# EAGLE design ArduinoLabDaughter (EAGLE 5.11)
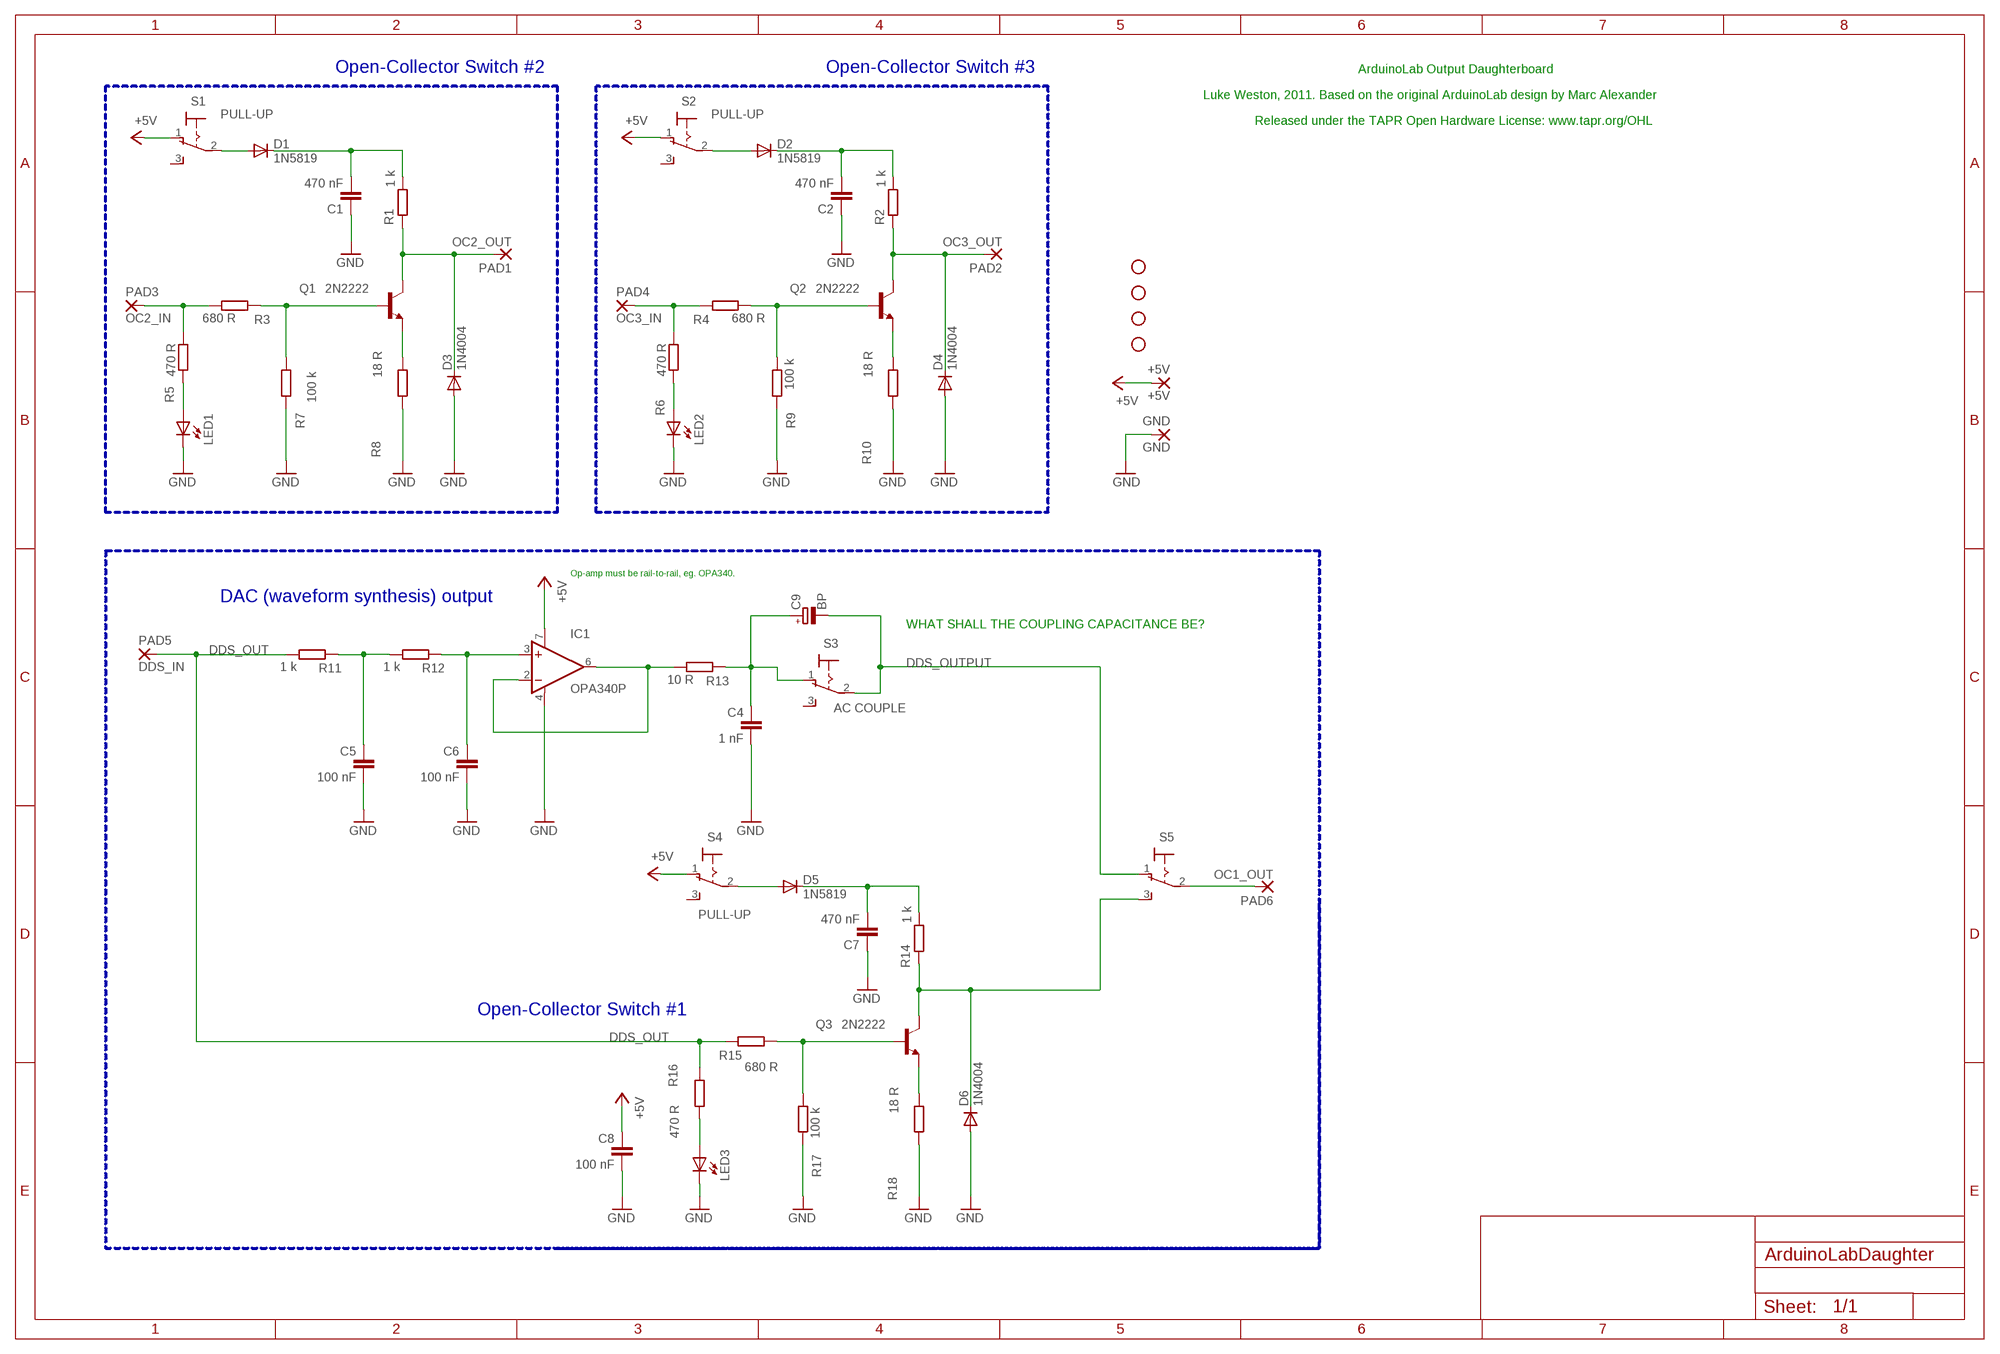
[diagram p0: schematic, sheet 1]

## Parts
+5V  +5V  WIREPAD3,81/1,3  [3,81/1,3]
C1  470 nF  C-EU025-024X044  [C025-024X044]
C2  470 nF  C-EU025-024X044  [C025-024X044]
C4  1 nF  C-EU025-024X044  [C025-024X044]
C5  100 nF  C-EU025-024X044  [C025-024X044]
C6  100 nF  C-EU025-024X044  [C025-024X044]
C7  470 nF  C-EU025-024X044  [C025-024X044]
C8  100 nF  C-EU025-024X044  [C025-024X044]
C9  BP  CPOL-EUE2.5-7  [E2,5-7]
D1  1N5819  DIODE-D-10  [D-10]
D2  1N5819  DIODE-D-10  [D-10]
D3  1N4004  DIODE-D-10  [D-10]
D4  1N4004  DIODE-D-10  [D-10]
D5  1N5819  DIODE-D-10  [D-10]
D6  1N4004  DIODE-D-10  [D-10]
GND  GND  WIREPAD3,81/1,3  [3,81/1,3]
IC1  OPA340P  [DIL08]
JP1  STAND-OFF  [STAND-OFF]
JP2  STAND-OFF  [STAND-OFF]
JP3  STAND-OFF  [STAND-OFF]
JP4  STAND-OFF  [STAND-OFF]
LED1  LED3MM  [LED3MM]
LED2  LED3MM  [LED3MM]
LED3  LED3MM  [LED3MM]
PAD1  OC2_OUT  WIREPAD3,81/1,3  [3,81/1,3]
PAD2  OC3_OUT  WIREPAD3,81/1,3  [3,81/1,3]
PAD3  OC2_IN  WIREPAD3,81/1,3  [3,81/1,3]
PAD4  OC3_IN  WIREPAD3,81/1,3  [3,81/1,3]
PAD5  DDS_IN  WIREPAD3,81/1,3  [3,81/1,3]
PAD6  OC1_OUT  WIREPAD3,81/1,3  [3,81/1,3]
Q1  2N2222  [TO92-EBC-OVAL]
Q2  2N2222  [TO92-EBC-OVAL]
Q3  2N2222  [TO92-EBC-OVAL]
R1  1 k  R-EU_0207/10  [0207/10]
R2  1 k  R-EU_0207/10  [0207/10]
R3  680 R  R-EU_0207/10  [0207/10]
R4  680 R  R-EU_0207/10  [0207/10]
R5  470 R  R-EU_0207/10  [0207/10]
R6  470 R  R-EU_0207/10  [0207/10]
R7  100 k  R-EU_0207/10  [0207/10]
R8  18 R  R-EU_0207/10  [0207/10]
R9  100 k  R-EU_0207/10  [0207/10]
R10  18 R  R-EU_0207/10  [0207/10]
R11  1 k  R-EU_0207/10  [0207/10]
R12  1 k  R-EU_0207/10  [0207/10]
R13  10 R  R-EU_0207/10  [0207/10]
R14  1 k  R-EU_0207/10  [0207/10]
R15  680 R  R-EU_0207/10  [0207/10]
R16  470 R  R-EU_0207/10  [0207/10]
R17  100 k  R-EU_0207/10  [0207/10]
R18  18 R  R-EU_0207/10  [0207/10]
S1  PULL-UP  320-916  [320-916]
S2  PULL-UP  320-916  [320-916]
S3  AC COUPLE  320-916  [320-916]
S4  PULL-UP  320-916  [320-916]
S5  320-916  [320-916]

## Nets
+5V: +5V.1(P) C8.1 IC1.7(V+) S1.1(O) S2.1(O) S4.1(O)
DDS_OUT: PAD5.1(P) R11.1 R15.1 R16.2
DDS_OUTPUT: C9.- S3.2(P) S5.1(O)
GND: C1.1 C2.1 C4.2 C5.2 C6.2 C7.1 C8.2 D3.A D4.A D6.A GND.1(P) IC1.4(V-) LED1.K(C) LED2.K(C) LED3.K(C) R7.1 R8.2 R9.1 R10.2 R17.1 R18.2
N$2: PAD6.1(P) S5.2(P)
N$34: Q1.B R3.2 R7.2
N$35: Q3.B R15.2 R17.2
N$36: Q3.E R18.1
N$37: IC1.2(-IN) IC1.6(OUT) R13.1
N$40: D6.C Q3.C R14.2 S5.3(S)
N$41: C7.2 D5.C R14.1
N$49: C4.1 C9.+ R13.2 S3.1(O)
N$50: Q1.E R8.1
N$55: D3.C PAD1.1(P) Q1.C R1.2
N$56: C5.1 R11.2 R12.1
N$57: C6.1 IC1.3(+IN) R12.2
N$61: LED3.A R16.1
N$62: D5.A S4.2(P)
N$63: C1.2 D1.C R1.1
N$64: LED1.A R5.1
N$65: D1.A S1.2(P)
N$66: Q2.B R4.2 R9.2
N$67: Q2.E R10.1
N$68: D4.C PAD2.1(P) Q2.C R2.2
N$69: C2.2 D2.C R2.1
N$70: LED2.A R6.1
N$71: D2.A S2.2(P)
OC2_OUT: PAD3.1(P) R3.1 R5.2
OC3_OUT: PAD4.1(P) R4.1 R6.2
Unconnected: S1.3(S) S2.3(S) S3.3(S) S4.3(S)

## Buses
B$1

## Notes on the sheet
- Open-Collector Switch #2 | Open-Collector Switch #3 | ArduinoLab Output Daughterboard
- Luke Weston, 2011. Based on the original ArduinoLab design by Marc Alexander
- Released under the TAPR Open Hardware License: www.tapr.org/OHL
- Op-amp must be rail-to-rail, eg. OPA340.
- DAC (waveform synthesis) output
- WHAT SHALL THE COUPLING CAPACITANCE BE?
- Open-Collector Switch #1

## Library data of the parts
+5V GND PAD1-PAD6 = wirepad:WIREPAD: Wire PAD connect wire on PCB
C1 C2 C4-C8 = rcl:C-EU: CAPACITOR, European symbol
C9 = rcl:CPOL-EU: POLARIZED CAPACITOR, European symbol
D1-D6 = diode:DIODE-: DIODE
IC1 = burr-brown:OPA340: Rail-to-Rail Operational Amplifiers Single-Supply, MicroAmplifier(TM) Series
JP1-JP4 = SparkFun:STAND-OFF: Stand Off This is the mechanical footprint for a #4 phillips button head screw. Use the keepout ring to avoid running the screw head into surrounding components. SKU : PRT-00447
LED1-LED3 = led:LED: LED OSRAM: - CHIPLED LG R971, LG N971, LY N971, LG Q971, LY Q971, LO R971, LY R971 LH N974, LH R974 LS Q976, LO Q976, LY Q976 LO Q996 - Hyper CHIPLED LW Q18S LB Q993, LB Q99A, LB R99A - SideLED LS A670, LO A670, LY A670, LG A670, LP A670 LB A673, LV A673, LT A673, LW A673 LH A674 LY A675 LS A676, LA A676, LO A676, LY A676, LW A676 LS A679, LY A679, LG A679 - Hyper Micro SIDELED® LS Y876, LA Y876, LO Y876, LY Y876 LT Y87S - SmartLED LW L88C, LW L88S LB L89C, LB L89S, LG L890 LS L89K, LO L89K, LY L89K LS L896, LA L896, LO L896, LY L896 - TOPLED LS T670, LO T670, LY T670, LG T670, LP T670 LSG T670, LSP T670, LSY T670, LOP T670, LYG T670 LG T671, LOG T671, LSG T671 LB T673, LV T673, LT T673, LW T673 LH T674 LS T676, LA T676, LO T676, LY T676, LB T676, LH T676, LSB T676, LW T676 LB T67C, LV T67C, LT T67C, LS T67K, LO T67K, LY T67K, LW E67C LS E67B, LA E67B, LO E67B, LY E67B, LB E67C, LV E67C, LT E67C LW T67C LS T679, LY T679, LG T679 LS T770, LO T770, LY T770, LG T770, LP T770 LB T773, LV T773, LT T773, LW T773 LH T774 LS E675, LA E675, LY E675, LS T675 LS T776, LA T776, LO T776, LY T776, LB T776 LHGB T686 LT T68C, LB T68C - Hyper Mini TOPLED® LB M676 - Mini TOPLED Santana® LG M470 LS M47K, LO M47K, LY M47K Source: http://www.osram.convergy.de LUXEON: - LUMILED® LXK2-PW12-R00, LXK2-PW12-S00, LXK2-PW14-U00, LXK2-PW14-V00 LXK2-PM12-R00, LXK2-PM12-S00, LXK2-PM14-U00 LXK2-PE12-Q00, LXK2-PE12-R00, LXK2-PE12-S00, LXK2-PE14-T00, LXK2-PE14-U00 LXK2-PB12-K00, LXK2-PB12-L00, LXK2-PB12-M00, LXK2-PB14-N00, LXK2-PB14-P00, LXK2-PB14-Q00 LXK2-PR12-L00, LXK2-PR12-M00, LXK2-PR14-Q00, LXK2-PR14-R00 LXK2-PD12-Q00, LXK2-PD12-R00, LXK2-PD12-S00 LXK2-PH12-R00, LXK2-PH12-S00 LXK2-PL12-P00, LXK2-PL12-Q00, LXK2-PL12-R00 Source: www.luxeon.com KINGBRIGHT: KA-3528ASYC Source: www.kingbright.com
Q1-Q3 = adafruit:2N2222: NPN TRANSISTOR Big oval pads
R1-R18 = rcl:R-EU_: RESISTOR, European symbol
S1-S5 = switch:320-916: TOGGLE SWITCH distributor RS Components

## Board
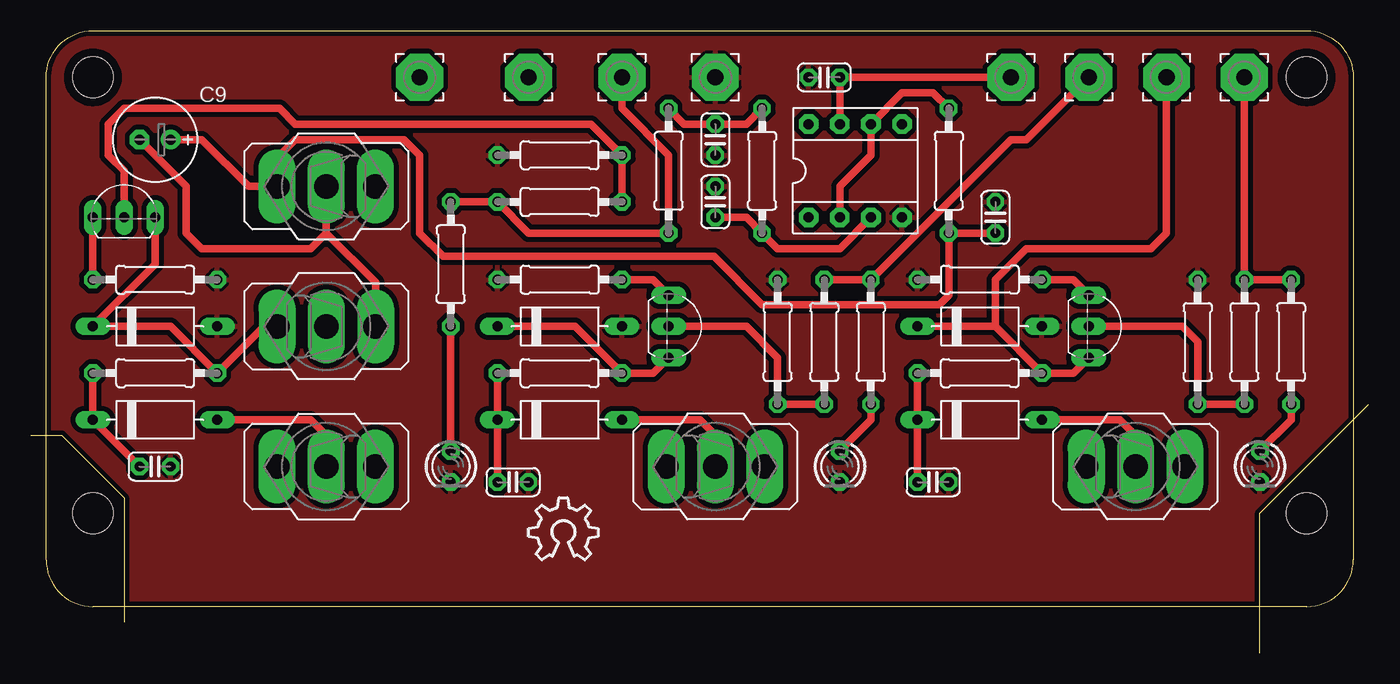
[diagram p1: board, top side]
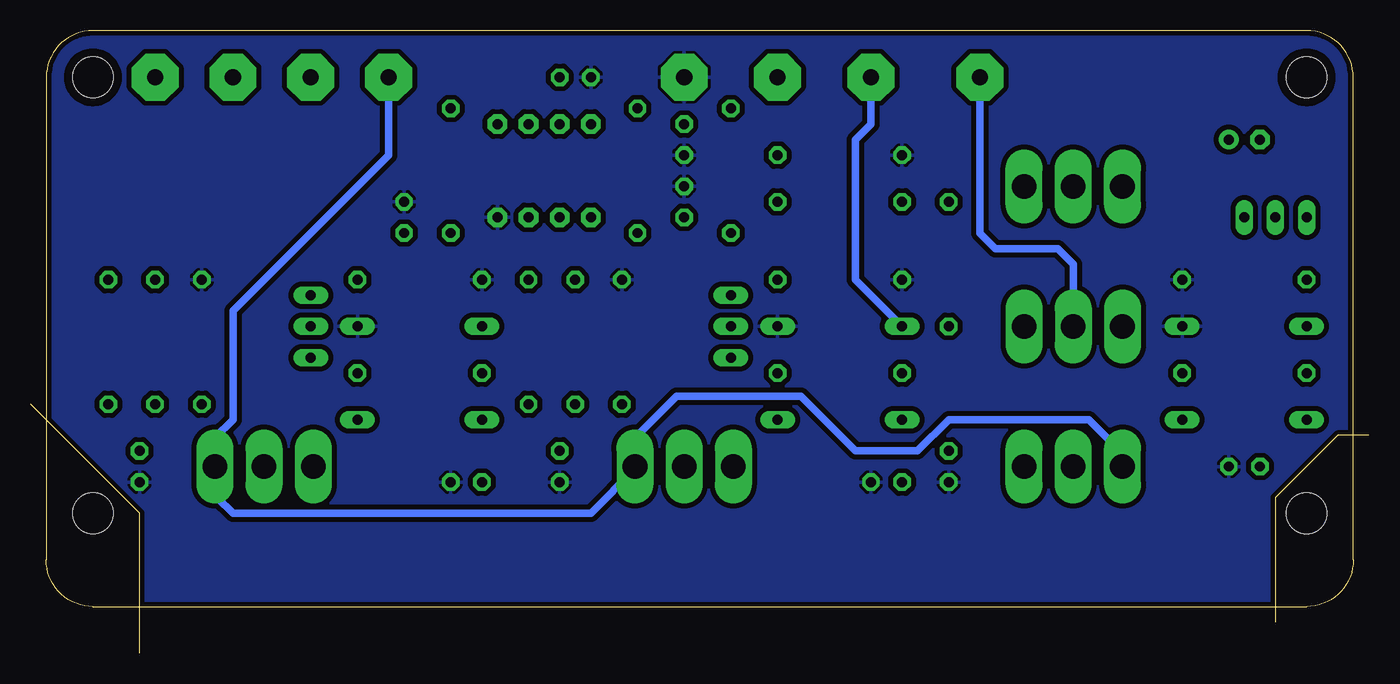
[diagram p2: board, bottom side, seen from below]

Size 109.22 x 50.8 mm. Coordinates in mm from the lower left corner, seen from the top.
Outline: 0,17.78 2.54,17.78 7.62,12.7 7.62,2.54
Outline: 100.33,0 100.33,11.43 109.22,20.32
Outline: 5.08,50.8 104.14,50.8 arc-90 107.95,46.99 107.95,7.62 arc-90 104.14,3.81 5.08,3.81 arc-90 1.27,7.62 1.27,46.99 arc-90 5.08,50.8
Copper layers (1*16): Top 0.035mm / dielectric 1.5mm / Bottom 0.035mm
Design rules "SparkFun.drc": minimum track width 8mil, minimum drill 20mil, track to track 8mil, track to pad 8mil, pad to pad 8mil, via to via 8mil, smd to smd 8mil, copper to edge 10mil, drill to drill 8mil, minimum pad ring 12mil, minimum via ring 10mil, stop-mask expansion 4mil, vias tented up to drill 25mil, thermal gap 10mil

### Footprints (pad centres in the part's own frame; a part is rotated, then mirrored left to right if it is on the bottom)
3,81/1,3 = drill 1.321 pad 3.81 octagon: 1 0,0
C025-024X044 = drill 0.813 octagon: 1 -1.27,0; 2 1.27,0
E2,5-7 = drill 0.813 pad 1.6 round: + -1.27,0 | drill 0.813 pad 1.6 octagon: - 1.27,0
D-10 = drill 0.813 long: A 5.08,0; C -5.08,0
DIL08 = drill 0.813 pad 1.6 octagon: 1 -3.81,-3.81; 2 -1.27,-3.81; 3 1.27,-3.81; 4 3.81,-3.81; 5 3.81,3.81; 6 1.27,3.81; 7 -1.27,3.81; 8 -3.81,3.81
STAND-OFF = hole 3.302: 0,0
LED3MM = drill 0.813 octagon: A -1.27,0; K 1.27,0
TO92-EBC-OVAL = drill 0.813 long: B 0,-1.27; C 2.54,-1.27; E -2.54,-1.27
0207/10 = drill 0.813 octagon: 1 -5.08,0; 2 5.08,0
320-916 = drill 2.007 long: 1 0,4.013; 2 0,0; 3 0,-4.013

### Placement (x,y rotation side)
+5V  80.01,46.99 0 top
C1  39.37,13.97 180 top
C2  73.66,13.97 180 top
C4  78.74,35.56 90 top
C5  55.88,41.91 270 top
C6  55.88,36.83 90 top
C7  10.16,15.24 180 top
C8  64.77,46.99 180 top
C9  10.16,41.91 180 top
D1  43.18,19.05 0 top
D2  77.47,19.05 0 top
D3  43.18,26.67 0 top
D4  77.47,26.67 0 top
D5  10.16,19.05 0 top
D6  10.16,26.67 0 top
GND  55.88,46.99 0 top
IC1  67.31,39.37 0 top
JP1  5.08,46.99 0 top
JP2  5.08,11.43 0 top
JP3  104.14,46.99 0 top
JP4  104.14,11.43 0 top
LED1  66.04,15.24 270 top
LED2  100.33,15.24 270 top
LED3  34.29,15.24 270 top
PAD1  40.64,46.99 180 top
PAD2  92.71,46.99 180 top
PAD3  86.36,46.99 180 top
PAD4  99.06,46.99 180 top
PAD5  48.26,46.99 180 top
PAD6  31.75,46.99 0 top
Q1  53.34,26.67 270 top
Q2  87.63,26.67 270 top
Q3  7.62,36.83 0 top
R1  43.18,22.86 0 top
R2  77.47,22.86 0 top
R3  64.77,25.4 270 top
R4  99.06,25.4 270 top
R5  68.58,25.4 90 top
R6  102.87,25.4 90 top
R7  60.96,25.4 270 top
R8  43.18,30.48 180 top
R9  95.25,25.4 270 top
R10  77.47,30.48 180 top
R11  52.07,39.37 90 top
R12  59.69,39.37 270 top
R13  74.93,39.37 270 top
R14  10.16,22.86 0 top
R15  43.18,36.83 0 top
R16  34.29,31.75 90 top
R17  43.18,40.64 0 top
R18  10.16,30.48 0 top
S1  55.88,15.24 270 top
S2  90.17,15.24 270 top
S3  24.13,38.1 90 top
S4  24.13,15.24 90 top
S5  24.13,26.67 270 top
U$1  [OSHW_10X200_NOTEXT]  40.64,7.62 0 top

### Tracks (layer width: path | path; a pad name or v marks a point on that pad's centre or on a via)
+5V
  Top 0.61: IC1.7 C8.1 +5V.1
  Bottom 0.406: S1.1 59.89,15.04
  Bottom 0.61: S1.1 59.89,17.58 56.52,20.95 46.35,20.95 41.91,16.51 36.83,16.51 34.29,19.05 22.86,19.05 20.32,16.51 20.32,15.24 S4.1 | 59.89,15.04 63.5,11.43 92.71,11.43 93.98,12.7 93.98,15.04 S2.1 94.18,17.58 92.71,19.05 92.71,27.94 80.01,40.64 +5V.1
DDS_OUT
  Top 0.61: R16.2 R15.1 40.64,34.29 R11.1 52.07,40.64 48.26,44.45 PAD5.1
DDS_OUTPUT
  Top 0.61: 24.13,34.29 S3.2 | S5.1 28.14,30.28 24.13,34.29 | 24.13,34.29 22.86,33.02 13.97,33.02 12.7,34.29 12.7,38.1 C9.-
GND
  pour Top (isolate 0.406): 111.76,1.27 -2.54,1.27 -2.54,55.88 111.76,55.88
  pour Bottom (isolate 0.406): -1.27,53.34 109.22,53.34 109.22,2.54 -1.27,2.54
N$2
  Bottom 0.61: S5.2 24.13,31.75 25.4,33.02 30.48,33.02 31.75,34.29 PAD6.1
N$34
  Top 0.61: Q1.B 58.42,26.67 60.96,24.13 R7.2 R3.2
N$35
  Top 0.61: R15.2 R17.2 45.72,43.18 21.59,43.18 20.32,44.45 7.62,44.45 6.35,43.18 6.35,40.64 7.62,39.37 Q3.B
N$36
  Top 0.61: R18.1 Q3.E
N$37
  Top 0.61: IC1.2 66.04,38.1 68.58,40.64 IC1.6 71.12,45.72 73.66,45.72 R13.1
N$40
  Top 0.61: Q3.C 10.16,31.75 D6.C 11.43,26.67 R14.2 19.05,26.67 S5.3
N$41
  Top 0.61: R14.1 D5.C C7.2
N$49
  Top 0.61: C4.1 R13.2 74.93,29.21 74.17,28.45 59.69,28.45 55.75,32.39 33.66,32.39 31.75,34.29 31.75,40.64 30.48,41.91 21.59,41.91 20.12,40.44 S3.1 17.78,38.1 13.97,41.91 C9.+
N$50
  Top 0.61: R8.1 50.8,30.48 Q1.E
N$55
  Top 0.61: Q1.C 50.8,22.86 R1.2 44.45,26.67 D3.C
  Bottom 0.61: D3.C 41.91,30.48 41.91,41.91 40.64,43.18 PAD1.1
N$56
  Top 0.61: R11.2 53.34,43.18 C5.1 58.42,43.18 R12.1
N$57
  Top 0.61: C6.1 58.42,35.56 R12.2 60.96,33.02 66.04,33.02 IC1.3
N$61
  Top 0.61: LED3.A R16.1
N$62
  Top 0.61: D5.A 22.86,19.05 24.13,17.78 S4.2
N$63
  Top 0.61: C1.2 D1.C R1.1
N$64
  Top 0.61: R5.1 68.58,19.05 LED1.A
N$65
  Top 0.61: D1.A 54.61,19.05 55.88,17.78 S1.2
N$66
  Top 0.61: R4.2 R9.2 95.25,25.4 93.98,26.67 Q2.B
N$67
  Top 0.61: Q2.E 85.09,30.48 R10.1
N$68
  Top 0.61: 78.74,26.67 R2.2 85.09,22.86 Q2.C | D4.C 78.74,26.67 | PAD2.1 92.71,34.29 91.44,33.02 81.28,33.02 78.74,30.48 78.74,26.67
N$69
  Top 0.61: C2.2 D2.C R2.1
N$70
  Top 0.61: R6.1 102.87,19.05 LED2.A
N$71
  Top 0.61: D2.A 88.9,19.05 90.17,17.78 S2.2
OC2_OUT
  Top 0.61: R3.1 R5.2 80.01,41.91 81.28,41.91 PAD3.1
OC3_OUT
  Top 0.61: R6.2 R4.1 PAD4.1

### Text on the board
Document: 107 mm x 47 mm | GND | CH1 OUT | CH2 OUT | CH1 IN | +5V | CH2 IN | CH3 OUT | CH3 IN | DC | AC | DDS AC COUPLE | DDS | CH1 MODE SELECT | CH3 ON | CH1 ON | CH2 ON | CH1 PULLUP | ON | ON | ON | CH2 PULLUP | CH3 PULLUP | ArduinoLab Open-Collector Output Board | Open Hardware | Released under the TAPR Open Hardware License: www.tapr.org/OHL | Luke Weston, 2011